# Altium schematic sheet io.SchDoc
size A4; SheetNumber: 2; SheetTotal: 4
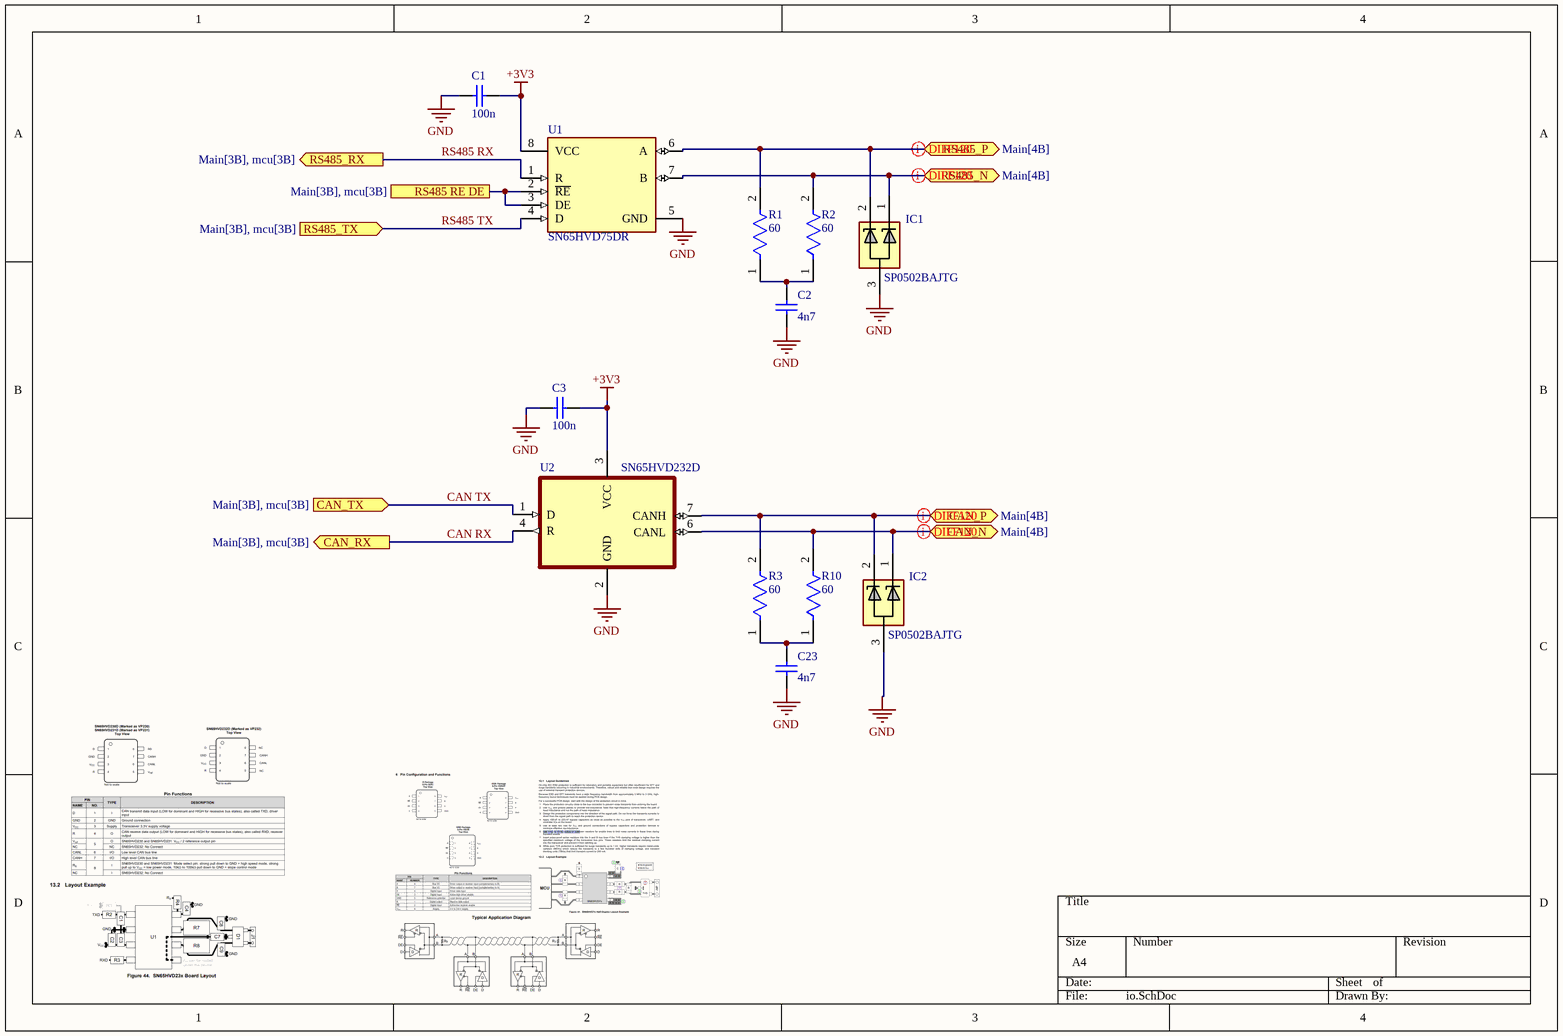
[diagram p0: io.SchDoc]

## Parts
C1  100n  [CAPC1206(3216)170_M]
C2  4n7  [CAPC1206(3216)150_L]
C3  100n  [CAPC1206(3216)170_M]
C23  4n7  [CAPC1206(3216)150_L]
IC1  SP0502BAJTG  [SOT132P220X110-3N]
IC2  SP0502BAJTG  [SOT132P220X110-3N]
R1  60  [FP-RK73H2B-MFG]
R2  60  [FP-RK73H2B-MFG]
R3  60  [FP-RK73H2B-MFG]
R10  60  [FP-RK73H2B-MFG]
U1  SN65HVD75DR  [SN65HVD75DR]
U2  SN65HVD232D  [SN65HVD232D]

## Ports
CAN_N (bidir, see Main[4B]), CAN_P (bidir, see Main[4B]), CAN_RX (out, see Main[3B], mcu[3B]), CAN_TX (in, see Main[3B], mcu[3B]), RS485 RE DE (see Main[3B], mcu[3B]), RS485_N (bidir, see Main[4B]), RS485_P (bidir, see Main[4B]), RS485_RX (out, see Main[3B], mcu[3B]), RS485_TX (in, see Main[3B], mcu[3B])

## Nets
+3V3: C1.1 C3.1 U1.8(VCC) U2.3(VCC)
GND: C1.2 C2.2 C3.2 C23.2 IC1.3 IC2.3 U1.5(GND) U2.2(GND)
CAN RX: U2.4(R) ; port CAN_RX
CAN TX: U2.1(D) ; port CAN_TX
CAN_N: IC2.1 R10.2 U2.6(CANL) ; port CAN_N
CAN_P: IC2.2 R3.2 U2.7(CANH) ; port CAN_P
RS485 RE DE: U1.2(~{RE}) U1.3(DE) ; port RS485 RE DE
RS485 RX: U1.1(R) ; port RS485_RX
RS485 TX: U1.4(D) ; port RS485_TX
RS485_N: IC1.1 R2.2 U1.7(B) ; port RS485_N
RS485_P: IC1.2 R1.2 U1.6(A) ; port RS485_P
NetC2_1: C2.1 R1.1 R2.1
NetC23_1: C23.1 R3.1 R10.1

## Layout directives
differential pair; differential pair class DIFF120; net class RS485_P: RS485_P
differential pair; differential pair class DIFF120; net class RS485_N: RS485_N
differential pair; differential pair class DIFF120; net class CAN: CAN_N, CAN_P

## Library data of the parts
C1 C3 = CMP-1037-04008-1: CAP 47nF 200V ±10% 1206 (3216 Metric) Thickness 1.7mm SMD; Tolerance: Â±10%; Case-EIA: 1206; Case-Metric: 3216; Technology: SMT; Max Thickness: 1.7 mm; Value: 47nF; Rated Voltage: 200 V
C2 C23 = CMP-1037-04778-1: CAP 1.8uF 10V ±5% 1206 (3216 Metric) Thickness 1.45mm SMD; Case-EIA: 1206; Tolerance: Â±5%; Case-Metric: 3216; Technology: SMT; Value: 1.8uF; Rated Voltage: 10 V; Max Thickness: 1.45 mm
IC1 IC2 = SP0502BAJTG: Integrated Circuit; Manufacturer_Name: LITTELFUSE; Datasheet Link: https://www.littelfuse.com/~/media/electronics/datasheets/tvs_diode_arrays/littelfuse_tvs_diode_array_sp05_datasheet.pdf.pdf; Height: 1.1mm; Manufacturer_Part_Number: SP0502BAJTG; Mouser Part Number: 576-SP0502BAJTG; Mouser Price/Stock: https://www.mouser.co.uk/ProductDetail/Littelfuse/SP0502BAJTG?qs=RnOBYWd%2Fz7cttN1Mwg4HWA%3D%3D; Arrow Part Number: SP0502BAJTG; Arrow Price/Stock: https://www.arrow.com/en/products/sp0502bajtg/littelfuse?region=nac
R1-R3 R10 = CMP-04015-098385-1: 40.2kΩ ±1% 0.25W Chip Resistor 1206 Thick Film AEC-Q200 Qualified; Resistance: 40.2kR; Voltage Rating (DC): 200V; Temperature Coefficient: 100ppm/°C; Power Rating: 250mW; Tolerance: 1%; Package Quantity: 5000; Length: 3.2mm; Termination: SMD/SMT; Lead Free: Contains Lead; Case Code (Imperial): 1206; Case/Package: 1206; Voltage Rating: 200V; Case Code (Metric): 3216; Max Operating Temperature: 155°C; Packaging: Tape and Reel; Width: 1.6mm; Series: RK73H; Min Operating Temperature: -55°C; RoHS Compliant: No; Height: 0.6mm
U1 = SN65HVD75DR: Single Transmitter/Receiver RS-422/RS-485 8-Pin SOIC T/R; Manufacturer: Texas Instruments; Manufacturer Lifecycle Status: ACTIVE; Data Rate: 20Mbps; Interface: RS-422, RS-485; Logic Function: Transceiver; Max Junction Temperature (Tj): 150°C; Max Supply Voltage: 3.6V; Min Supply Voltage: 3V; Nominal Supply Current: 950µA; Number of Drivers: 1; Operating Supply Voltage: 3.3V; Receiver Hysteresis: 80mV; Simplex/Duplex: Half Duplex; Supplier: DigiKey; Supplier Part Number: 296-38570-1-ND; Manufacturer Part Number: SN65HVD75DR; RoHS: Compliant; Category: RS-232 / RS-422 / RS-485 Interface ICs; Stock: 19374; Pricing: 1=2,18, 10=1,612, 25=1,4704, 100=1,3144, 250=1,24008, 500=1,19528, 1000=1,15839 (USD); Ambient Temperature Range High: 125°C; Case/Package: SOIC; Contact Plating: Gold; Height: 1.75mm; Lead Free: Lead Free; Length: 4.9mm; Lifecycle Status: Production; Max Operating Temperature: 125°C; Min Operating Temperature: -40°C; Pins: 8; Number of Receivers: 1; Number of Transceivers: 1; Number of Transmitters: 1; Packaging: Tape and Reel; Radiation Hardening: No; REACH SVHC: No; Schedule B: 8542390000, 8542390000|8542390000|8542390000|8542390000|8542390000; Thickness: 1.58mm; Width: 3.91mm; ComponentLink1URL: https://datasheet.octopart.com:443/SN65HVD75DR-Texas-Instruments-datasheet-22138306.pdf?src-supplier=Texas+Instruments; ComponentLink1Description: https://datasheet.octopart.com:443/SN65HVD75DR-Texas-Instruments-datasheet-22138306.pdf?src-supplier=Texas+Instruments; ComponentLink2URL: https://octopart.com:443/opatz8j6/c1?t=n-jLi9Hpj9Y1CtPvMq2wOWlt-fEIf69pcO_lcFh_oE0lP0UEYhb18J_Iy_8ZFNUCuyymRdaX8eMNg-AWn_ExZtGn32Zq0CkiG1pBHU4b6nja_Za_5YDFtI7XDIx6JgM7tTBVSWQxX3zpR6GJKtqTpFn4N3Px7iL7giCcRUdPhbCOuuMtZjzDAulhRL4-l8kJRFa8ZYcsDjWofUjrYJp33V_cFwj6fSgilYVUsUehb6BTYstndtkD3u_E8yWStnyvQ9RuB-KDft8Cssj0uzNxAssUSPlx5j82pqaHF34l0kh9MV0qibcgTRJzKY6eoGJoP4efwPiAV05SwETRDTp4KaeNuvVDeUjJsgbn-0JDhnvl-36UpEO5PxKaD1Xwrs2QC2UoaCMc&src-supplier=Texas+Instruments; ComponentLink2Description: https://octopart.com:443/opatz8j6/c1?t=n-jLi9Hpj9Y1CtPvMq2wOWlt-fEIf69pcO_lcFh_oE0lP0UEYhb18J_Iy_8ZFNUCuyymRdaX8eMNg-AWn_ExZtGn32Zq0CkiG1pBHU4b6nja_Za_5YDFtI7XDIx6JgM7tTBVSWQxX3zpR6GJKtqTpFn4N3Px7iL7giCcRUdPhbCOuuMtZjzDAulhRL4-l8kJRFa8ZYcsDjWofUjrYJp33V_cFwj6fSgilYVUsUehb6BTYstndtkD3u_E8yWStnyvQ9RuB-KDft8Cssj0uzNxAssUSPlx5j82pqaHF34l0kh9MV0qibcgTRJzKY6eoGJoP4efwPiAV05SwETRDTp4KaeNuvVDeUjJsgbn-0JDhnvl-36UpEO5PxKaD1Xwrs2QC2UoaCMc&src-supplier=Texas+Instruments; ComponentLink3URL: https://datasheet.octopart.com:443/SN65HVD75DR-Texas-Instruments-datasheet-17762390.pdf?src-supplier=Texas+Instruments; ComponentLink3Description: https://datasheet.octopart.com:443/SN65HVD75DR-Texas-Instruments-datasheet-17762390.pdf?src-supplier=Texas+Instruments; ComponentLink4URL: https://datasheet.octopart.com:443/SN65HVD75DR-Texas-Instruments-datasheet-13302759.pdf?src-supplier=Texas+Instruments; ComponentLink4Description: https://datasheet.octopart.com:443/SN65HVD75DR-Texas-Instruments-datasheet-13302759.pdf?src-supplier=Texas+Instruments; ComponentLink5URL: https://datasheet.octopart.com:443/SN65HVD75DR-Texas-Instruments-datasheet-12493769.pdf?src-supplier=Texas+Instruments; ComponentLink5Description: https://datasheet.octopart.com:443/SN65HVD75DR-Texas-Instruments-datasheet-12493769.pdf?src-supplier=Texas+Instruments; ComponentLink6URL: https://datasheet.octopart.com:443/SN65HVD75DR-Texas-Instruments-datasheet-11514831.pdf?src-supplier=Texas+Instruments; ComponentLink6Description: https://datasheet.octopart.com:443/SN65HVD75DR-Texas-Instruments-datasheet-11514831.pdf?src-supplier=Texas+Instruments; ComponentLink7URL: https://datasheet.octopart.com:443/SN65HVD75DR-Texas-Instruments-datasheet-10945678.pdf?src-supplier=Texas+Instruments; ComponentLink7Description: https://datasheet.octopart.com:443/SN65HVD75DR-Texas-Instruments-datasheet-10945678.pdf?src-supplier=Texas+Instruments; ComponentLink8URL: https://datasheet.octopart.com:443/SN65HVD75DR-Texas-Instruments-datasheet-10899452.pdf?src-supplier=Texas+Instruments; ComponentLink8Description: https://datasheet.octopart.com:443/SN65HVD75DR-Texas-Instruments-datasheet-10899452.pdf?src-supplier=Texas+Instruments; ComponentLink9URL: https://sigma.octopart.com:443/49249642/technical_drawing/Texas-Instruments-SN65HVD75DR.pdf?src-supplier=Texas+Instruments; ComponentLink9Description: https://sigma.octopart.com:443/49249642/technical_drawing/Texas-Instruments-SN65HVD75DR.pdf?src-supplier=Texas+Instruments; ComponentLink10URL: https://datasheet.octopart.com:443/SN65HVD75DR-Texas-Instruments-datasheet-47564841.pdf?src-supplier=Newark; ComponentLink10Description: https://datasheet.octopart.com:443/SN65HVD75DR-Texas-Instruments-datasheet-47564841.pdf?src-supplier=Newark; ComponentLink11URL: https://datasheet.octopart.com:443/SN65HVD75DR-Texas-Instruments-datasheet-62292549.pdf?src-supplier=Farnell; ComponentLink11Description: https://datasheet.octopart.com:443/SN65HVD75DR-Texas-Instruments-datasheet-62292549.pdf?src-supplier=Farnell; ComponentLink12URL: https://datasheet.octopart.com:443/SN65HVD75DR-Texas-Instruments-datasheet-67294880.pdf?src-supplier=Farnell; ComponentLink12Description: https://datasheet.octopart.com:443/SN65HVD75DR-Texas-Instruments-datasheet-67294880.pdf?src-supplier=Farnell; ComponentLink13URL: https://datasheet.octopart.com:443/SN65HVD75DR-Texas-Instruments-datasheet-165804306.pdf?src-supplier=LCSC; ComponentLink13Description: https://datasheet.octopart.com:443/SN65HVD75DR-Texas-Instruments-datasheet-165804306.pdf?src-supplier=LCSC; ComponentLink14URL: https://datasheet.octopart.com:443/SN65HVD75DR-Texas-Instruments-datasheet-159115721.pdf?src-supplier=LCSC; ComponentLink14Description: https://datasheet.octopart.com:443/SN65HVD75DR-Texas-Instruments-datasheet-159115721.pdf?src-supplier=LCSC; ComponentLink15URL: https://datasheet.octopart.com:443/SN65HVD75DR-Texas-Instruments-datasheet-164416300.pdf?src-supplier=SHENGYU+ELECTRONICS; ComponentLink15Description: https://datasheet.octopart.com:443/SN65HVD75DR-Texas-Instruments-datasheet-164416300.pdf?src-supplier=SHENGYU+ELECTRONICS; ComponentLink16URL: https://datasheet.octopart.com:443/SN65HVD75DR-Texas-Instruments-datasheet-137316104.pdf?src-supplier=Future+Electronics; ComponentLink16Description: https://datasheet.octopart.com:443/SN65HVD75DR-Texas-Instruments-datasheet-137316104.pdf?src-supplier=Future+Electronics; ComponentLink17URL: https://datasheet.octopart.com:443/SN65HVD75DR-Texas-Instruments-datasheet-140571633.pdf?src-supplier=Arrow.cn; ComponentLink17Description: https://datasheet.octopart.com:443/SN65HVD75DR-Texas-Instruments-datasheet-140571633.pdf?src-supplier=Arrow.cn; ComponentLink18URL: https://datasheet.octopart.com:443/SN65HVD75DR-Texas-Instruments-datasheet-11568815.pdf?src-supplier=Arrow+Electronics; ComponentLink18Description: https://datasheet.octopart.com:443/SN65HVD75DR-Texas-Instruments-datasheet-11568815.pdf?src-supplier=Arrow+Electronics; ComponentLink19URL: http://sigma.octopart.com:80/reach_statement/Texas-Instruments-company-64.pdf?src-supplier=Compliance+Statements; ComponentLink19Description: http://sigma.octopart.com:80/reach_statement/Texas-Instruments-company-64.pdf?src-supplier=Compliance+Statements; ComponentLink20URL: http://sigma.octopart.com:80/conflict_mineral_statement/Texas-Instruments-company-63.pdf?src-supplier=Compliance+Statements; ComponentLink20Description: http://sigma.octopart.com:80/conflict_mineral_statement/Texas-Instruments-company-63.pdf?src-supplier=Compliance+Statements
U2 = SN65HVD232D: Texas Instruments - SN65HVD232DR - Can Transceiver, 1MBPS, 1/1, 3.3V, SOIC-8, Full Reel; Manufacturer Lifecycle Status: ACTIVE; Max Supply Voltage: 3.6V; Min Supply Voltage: 3V; Nominal Supply Current: 17mA; Number of Drivers: 1; SnapEDA_Link: https://www.snapeda.com/parts/SN65HVD232D/Texas+Instruments/view-part/?ref=snap; Package: SOIC-8 Texas Instruments; Value: *; MF: Texas Instruments; MP: SN65HVD232D; Check_prices: https://www.snapeda.com/parts/SN65HVD232D/Texas+Instruments/view-part/?ref=eda; Supplier: Arrow Electronics; Supplier Part Number: SN65HVD232DR; Manufacturer: Texas Instruments; Manufacturer Part Number: SN65HVD232DR; RoHS: Compliant; Category: CAN Transceivers; Stock: 10000; Pricing: 2500=1,1159, 5000=1,076, 7500=1,062 (USD); Case/Package: SOIC; Data Rate: 1Mbps; Height: 1.75mm; Lead Free: Lead Free; Length: 4.9mm; Lifecycle Status: Production; Max Operating Temperature: 85°C; Min Operating Temperature: -40°C; Pins: 8; Number of Receive Buffers: 1; Number of Receivers: 1; Number of Transceivers: 1; Number of Transmit Buffers: 1; Packaging: Cut Tape; Radiation Hardening: No; REACH SVHC: No; Schedule B: 8542390000, 8542390000|8542390000|8542390000|8542390000|8542390000; Thickness: 1.58mm; Weight: 72.603129mg; Width: 3.91mm; ComponentLink1URL: https://octopart.com:443/opatz8j6/c1?t=KNMFt9M64p-_id6rZ0-P1CX6CGmvk_NFg0bt7DHXbi_P10EFF0MZE_9gM8ERckOxIywTBgDrXd4Bw1XwEAcVVdK92p9CEfdSNaVajf6_bxnez3EeN1RE1wZBaojbXTwQ_101S7Bb856c3hUAWErS0_zGIM1B6Z6dFQwv_Ps2SUdVVUCjmJkLnMLZKTBWfnIVcgJIheW78JYanUyW_1u-I93chBuiSPXQYIk2xXb9JgOyrE9lHEnesRSQq9luJOd1yknyGQP0N3Is0_dGM9QrGV5UOgjoada9tMnQwKJP8gahr3iTK59XJFH6OfbHTOm3R9BdESCrBMbrE2MVOGPPkVOTrqf0YMovDpmf-konbncFnSES8CNOhHqMwHv2HEwKcPoK44nl&src-supplier=Texas+Instruments; ComponentLink1Description: https://octopart.com:443/opatz8j6/c1?t=KNMFt9M64p-_id6rZ0-P1CX6CGmvk_NFg0bt7DHXbi_P10EFF0MZE_9gM8ERckOxIywTBgDrXd4Bw1XwEAcVVdK92p9CEfdSNaVajf6_bxnez3EeN1RE1wZBaojbXTwQ_101S7Bb856c3hUAWErS0_zGIM1B6Z6dFQwv_Ps2SUdVVUCjmJkLnMLZKTBWfnIVcgJIheW78JYanUyW_1u-I93chBuiSPXQYIk2xXb9JgOyrE9lHEnesRSQq9luJOd1yknyGQP0N3Is0_dGM9QrGV5UOgjoada9tMnQwKJP8gahr3iTK59XJFH6OfbHTOm3R9BdESCrBMbrE2MVOGPPkVOTrqf0YMovDpmf-konbncFnSES8CNOhHqMwHv2HEwKcPoK44nl&src-supplier=Texas+Instruments; ComponentLink2URL: https://sigma.octopart.com:443/49249642/technical_drawing/Texas-Instruments-SN65HVD232DR.pdf?src-supplier=Texas+Instruments; ComponentLink2Description: https://sigma.octopart.com:443/49249642/technical_drawing/Texas-Instruments-SN65HVD232DR.pdf?src-supplier=Texas+Instruments; ComponentLink3URL: https://datasheet.octopart.com:443/SN65HVD232DR-Texas-Instruments-datasheet-81447765.pdf?src-supplier=Upverter; ComponentLink3Description: https://datasheet.octopart.com:443/SN65HVD232DR-Texas-Instruments-datasheet-81447765.pdf?src-supplier=Upverter; ComponentLink4URL: https://datasheet.octopart.com:443/SN65HVD232DR-Texas-Instruments-datasheet-37140773.pdf?src-supplier=Newark; ComponentLink4Description: https://datasheet.octopart.com:443/SN65HVD232DR-Texas-Instruments-datasheet-37140773.pdf?src-supplier=Newark; ComponentLink5URL: https://datasheet.octopart.com:443/SN65HVD232DR-Texas-Instruments-datasheet-14436966.pdf?src-supplier=Newark; ComponentLink5Description: https://datasheet.octopart.com:443/SN65HVD232DR-Texas-Instruments-datasheet-14436966.pdf?src-supplier=Newark; ComponentLink6URL: https://datasheet.octopart.com:443/SN65HVD232DR-Texas-Instruments-datasheet-58296547.pdf?src-supplier=Newark; ComponentLink6Description: https://datasheet.octopart.com:443/SN65HVD232DR-Texas-Instruments-datasheet-58296547.pdf?src-supplier=Newark; ComponentLink7URL: https://datasheet.octopart.com:443/SN65HVD232DR-Texas-Instruments-datasheet-48117850.pdf?src-supplier=Newark; ComponentLink7Description: https://datasheet.octopart.com:443/SN65HVD232DR-Texas-Instruments-datasheet-48117850.pdf?src-supplier=Newark; ComponentLink8URL: https://datasheet.octopart.com:443/SN65HVD232DR-Texas-Instruments-datasheet-10256024.pdf?src-supplier=Arrow+Electronics; ComponentLink8Description: https://datasheet.octopart.com:443/SN65HVD232DR-Texas-Instruments-datasheet-10256024.pdf?src-supplier=Arrow+Electronics; ComponentLink9URL: https://datasheet.octopart.com:443/SN65HVD232DR-Texas-Instruments-datasheet-149765.pdf?src-supplier=Mouser; ComponentLink9Description: https://datasheet.octopart.com:443/SN65HVD232DR-Texas-Instruments-datasheet-149765.pdf?src-supplier=Mouser; ComponentLink10URL: https://datasheet.octopart.com:443/SN65HVD232DR-Texas-Instruments-datasheet-62292544.pdf?src-supplier=Farnell; ComponentLink10Description: https://datasheet.octopart.com:443/SN65HVD232DR-Texas-Instruments-datasheet-62292544.pdf?src-supplier=Farnell; ComponentLink11URL: https://datasheet.octopart.com:443/SN65HVD232DR-Texas-Instruments-datasheet-164416263.pdf?src-supplier=SHENGYU+ELECTRONICS; ComponentLink11Description: https://datasheet.octopart.com:443/SN65HVD232DR-Texas-Instruments-datasheet-164416263.pdf?src-supplier=SHENGYU+ELECTRONICS; ComponentLink12URL: https://datasheet.octopart.com:443/SN65HVD232DR-Texas-Instruments-datasheet-159115712.pdf?src-supplier=LCSC; ComponentLink12Description: https://datasheet.octopart.com:443/SN65HVD232DR-Texas-Instruments-datasheet-159115712.pdf?src-supplier=LCSC; ComponentLink13URL: https://datasheet.octopart.com:443/SN65HVD232DR-Texas-Instruments-datasheet-137316104.pdf?src-supplier=Future+Electronics; ComponentLink13Description: https://datasheet.octopart.com:443/SN65HVD232DR-Texas-Instruments-datasheet-137316104.pdf?src-supplier=Future+Electronics; ComponentLink14URL: https://datasheet.octopart.com:443/SN65HVD232DR-Texas-Instruments-datasheet-8625468.pdf?src-supplier=Verical; ComponentLink14Description: https://datasheet.octopart.com:443/SN65HVD232DR-Texas-Instruments-datasheet-8625468.pdf?src-supplier=Verical; ComponentLink15URL: https://datasheet.octopart.com:443/SN65HVD232DR-Texas-Instruments-datasheet-8378736.pdf?src-supplier=Verical; ComponentLink15Description: https://datasheet.octopart.com:443/SN65HVD232DR-Texas-Instruments-datasheet-8378736.pdf?src-supplier=Verical; ComponentLink16URL: http://sigma.octopart.com:80/conflict_mineral_statement/Texas-Instruments-company-63.pdf?src-supplier=Compliance+Statements; ComponentLink16Description: http://sigma.octopart.com:80/conflict_mineral_statement/Texas-Instruments-company-63.pdf?src-supplier=Compliance+Statements; ComponentLink17URL: http://sigma.octopart.com:80/reach_statement/Texas-Instruments-company-64.pdf?src-supplier=Compliance+Statements; ComponentLink17Description: http://sigma.octopart.com:80/reach_statement/Texas-Instruments-company-64.pdf?src-supplier=Compliance+Statements